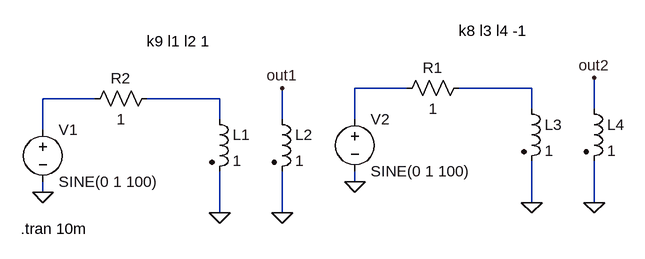
[diagram p0: schematic induc.asc]
induc.asc, the LTspice schematic file:
Version 4
SHEET 1 880 680
WIRE 432 80 352 80
WIRE 624 80 512 80
WIRE -48 96 -128 96
WIRE 144 96 32 96
WIRE 624 112 624 80
WIRE 720 112 720 64
WIRE 144 128 144 96
WIRE 240 128 240 80
WIRE 352 128 352 80
WIRE -128 144 -128 96
WIRE 352 224 352 208
WIRE -128 240 -128 224
WIRE 624 256 624 192
WIRE 720 256 720 192
WIRE 144 272 144 208
WIRE 240 272 240 208
FLAG 144 272 0
FLAG 240 272 0
FLAG 240 80 out1
FLAG -128 240 0
FLAG 624 256 0
FLAG 720 256 0
FLAG 720 64 out2
FLAG 352 224 0
SYMBOL ind2 128 112 R0
SYMATTR InstName L1
SYMATTR Value 1
SYMATTR Type ind
SYMBOL res 48 80 R90
WINDOW 0 0 56 VBottom 2
WINDOW 3 32 56 VTop 2
SYMATTR InstName R2
SYMATTR Value 1
SYMBOL voltage -128 128 R0
WINDOW 123 0 0 Left 0
WINDOW 39 0 0 Left 0
SYMATTR InstName V1
SYMATTR Value SINE(0 1 100)
SYMBOL ind2 224 112 R0
SYMATTR InstName L2
SYMATTR Value 1
SYMATTR Type ind
SYMBOL ind2 608 96 R0
SYMATTR InstName L3
SYMATTR Value 1
SYMATTR Type ind
SYMBOL res 528 64 R90
WINDOW 0 0 56 VBottom 2
WINDOW 3 32 56 VTop 2
SYMATTR InstName R1
SYMATTR Value 1
SYMBOL voltage 352 112 R0
WINDOW 123 0 0 Left 0
WINDOW 39 0 0 Left 0
SYMATTR InstName V2
SYMATTR Value SINE(0 1 100)
SYMBOL ind2 704 96 R0
SYMATTR InstName L4
SYMATTR Value 1
SYMATTR Type ind
TEXT -162 296 Left 2 !.tran 10m
TEXT 32 8 Left 2 !k9 l1 l2 1
TEXT 512 -8 Left 2 !k8 l3 l4 -1

The netlist it stands for:
* induc.asc
L1 N004 0 1
R2 N004 N003 1
V1 N003 0 SINE(0 1 100)
L2 out1 0 1
L3 N002 0 1
R1 N002 N001 1
V2 N001 0 SINE(0 1 100)
L4 out2 0 1
.tran 10m
k9 l1 l2 1
k8 l3 l4 -1
.backanno
.end